# Altium schematic sheet BOARD_CONNECTOR.SchDoc
size A3
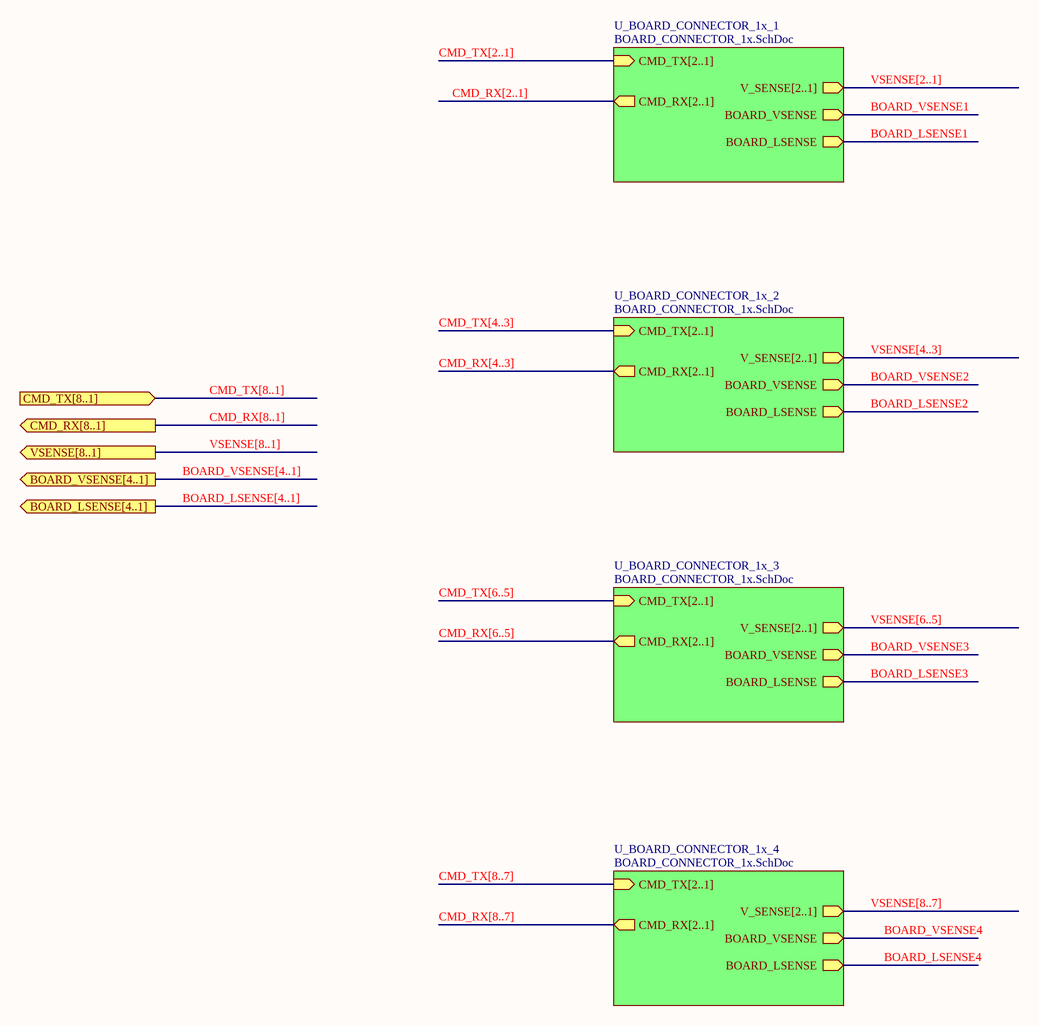
[diagram p0: BOARD_CONNECTOR.SchDoc]

## Sub-sheets
U_BOARD_CONNECTOR_1x_1 = BOARD_CONNECTOR_1x.SchDoc: CMD_TX[2..1] (in), CMD_RX[2..1] (out), BOARD_VSENSE (out), BOARD_LSENSE (out), V_SENSE[2..1] (out)
U_BOARD_CONNECTOR_1x_2 = BOARD_CONNECTOR_1x.SchDoc: CMD_TX[2..1] (in), CMD_RX[2..1] (out), BOARD_VSENSE (out), BOARD_LSENSE (out), V_SENSE[2..1] (out)
U_BOARD_CONNECTOR_1x_3 = BOARD_CONNECTOR_1x.SchDoc: CMD_TX[2..1] (in), CMD_RX[2..1] (out), BOARD_VSENSE (out), BOARD_LSENSE (out), V_SENSE[2..1] (out)
U_BOARD_CONNECTOR_1x_4 = BOARD_CONNECTOR_1x.SchDoc: CMD_TX[2..1] (in), CMD_RX[2..1] (out), BOARD_VSENSE (out), BOARD_LSENSE (out), V_SENSE[2..1] (out)

## Ports
BOARD_LSENSE[4..1] (out), BOARD_VSENSE[4..1] (out), CMD_RX[8..1] (out), CMD_TX[8..1] (in), VSENSE[8..1] (out)

## Nets
BOARD_LSENSE1: sheet U_BOARD_CONNECTOR_1x_1/BOARD_LSENSE
BOARD_LSENSE2: sheet U_BOARD_CONNECTOR_1x_2/BOARD_LSENSE
BOARD_LSENSE3: sheet U_BOARD_CONNECTOR_1x_3/BOARD_LSENSE
BOARD_LSENSE4: sheet U_BOARD_CONNECTOR_1x_4/BOARD_LSENSE
BOARD_VSENSE1: sheet U_BOARD_CONNECTOR_1x_1/BOARD_VSENSE
BOARD_VSENSE2: sheet U_BOARD_CONNECTOR_1x_2/BOARD_VSENSE
BOARD_VSENSE3: sheet U_BOARD_CONNECTOR_1x_3/BOARD_VSENSE
BOARD_VSENSE4: sheet U_BOARD_CONNECTOR_1x_4/BOARD_VSENSE

## Buses and harness runs
bus BOARD_LSENSE[4..1] = port BOARD_LSENSE[4..1]
bus BOARD_VSENSE[4..1] = port BOARD_VSENSE[4..1]
bus CMD_RX[2..1] = sheet U_BOARD_CONNECTOR_1x_1/CMD_RX[2..1]
bus CMD_RX[4..3] = sheet U_BOARD_CONNECTOR_1x_2/CMD_RX[2..1]
bus CMD_RX[6..5] = sheet U_BOARD_CONNECTOR_1x_3/CMD_RX[2..1]
bus CMD_RX[8..1] = port CMD_RX[8..1]
bus CMD_RX[8..7] = sheet U_BOARD_CONNECTOR_1x_4/CMD_RX[2..1]
bus CMD_TX[2..1] = sheet U_BOARD_CONNECTOR_1x_1/CMD_TX[2..1]
bus CMD_TX[4..3] = sheet U_BOARD_CONNECTOR_1x_2/CMD_TX[2..1]
bus CMD_TX[6..5] = sheet U_BOARD_CONNECTOR_1x_3/CMD_TX[2..1]
bus CMD_TX[8..1] = port CMD_TX[8..1]
bus CMD_TX[8..7] = sheet U_BOARD_CONNECTOR_1x_4/CMD_TX[2..1]
bus VSENSE[2..1] = sheet U_BOARD_CONNECTOR_1x_1/V_SENSE[2..1]
bus VSENSE[4..3] = sheet U_BOARD_CONNECTOR_1x_2/V_SENSE[2..1]
bus VSENSE[6..5] = sheet U_BOARD_CONNECTOR_1x_3/V_SENSE[2..1]
bus VSENSE[8..1] = port VSENSE[8..1]
bus VSENSE[8..7] = sheet U_BOARD_CONNECTOR_1x_4/V_SENSE[2..1]